# Altium project FusionVisionPCBScreen.PrjPcb
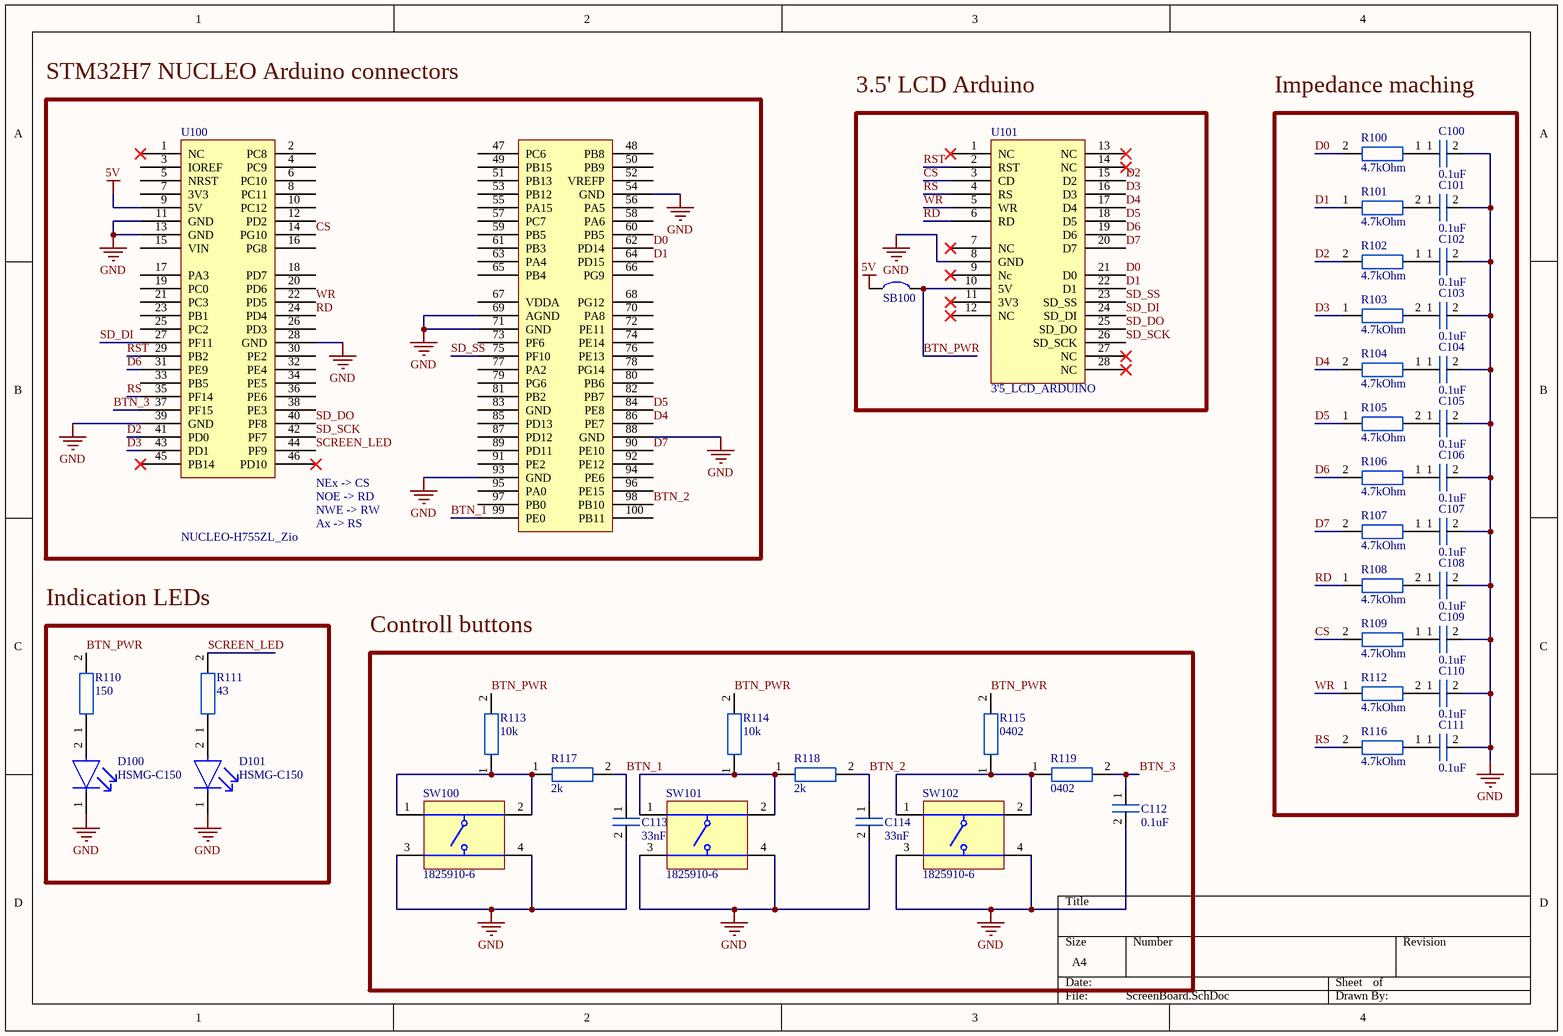
[diagram p0: ScreenBoard.SchDoc]
1 sheet, 43 parts. Net scope: global (net labels, ports and power ports of the same name join across sheets).
Board file: ScreenBoard.PcbDoc

## Sheet ScreenBoard.SchDoc
size A4; SheetNumber: 1; SheetTotal: 1

### Parts
C100  0.1uF  [0402_footprint]
C101  0.1uF  [0402_footprint]
C102  0.1uF  [0402_footprint]
C103  0.1uF  [0402_footprint]
C104  0.1uF  [0402_footprint]
C105  0.1uF  [0402_footprint]
C106  0.1uF  [0402_footprint]
C107  0.1uF  [0402_footprint]
C108  0.1uF  [0402_footprint]
C109  0.1uF  [0402_footprint]
C110  0.1uF  [0402_footprint]
C111  0.1uF  [0402_footprint]
C112  0.1uF  [0402_footprint]
C113  33nF  [0402_footprint]
C114  33nF  [0402_footprint]
D100  HSMG-C150  [FP-HSMG-C150-MFG]
D101  HSMG-C150  [FP-HSMG-C150-MFG]
R100  4.7kOhm  [0402_footprint]
R101  4.7kOhm  [0402_footprint]
R102  4.7kOhm  [0402_footprint]
R103  4.7kOhm  [0402_footprint]
R104  4.7kOhm  [0402_footprint]
R105  4.7kOhm  [0402_footprint]
R106  4.7kOhm  [0402_footprint]
R107  4.7kOhm  [0402_footprint]
R108  4.7kOhm  [0402_footprint]
R109  4.7kOhm  [0402_footprint]
R110  150  [0402_footprint]
R111  43  [0402_footprint]
R112  4.7kOhm  [0402_footprint]
R113  10k  [0402_footprint]
R114  10k  [0402_footprint]
R115  0402  [0402_footprint]
R116  4.7kOhm  [0402_footprint]
R117  2k  [0402_footprint]
R118  2k  [0402_footprint]
R119  0402  [0402_footprint]
SB100  Solder_bridge  [SOLDER_BRIDGE]  (value not drawn)
SW100  1825910-6  [TECO-1825910-6_V]
SW101  1825910-6  [TECO-1825910-6_V]
SW102  1825910-6  [TECO-1825910-6_V]
U100  NUCLEO-H755ZL_Zio  [H7/H5_NUCLEO_Zio]
U101  3'5_LCD_ARDUINO  [3'5_LCD_ARDUINO]

### Blocks framed on the sheet
STM32H7 NUCLEO Arduino connectors: U100
3.5' LCD Arduino: SB100 U101
Impedance maching: C100-C111 R100-R109 R112 R116
Indication LEDs: D100 D101 R110 R111
Controll buttons: C112-C114 R113-R115 R117-R119 SW100-SW102

### Nets
5V: SB100.1 U100.9(5V)
GND: C100.2 C101.2 C102.2 C103.2 C104.2 C105.2 C106.2 C107.2 C108.2 C109.2 C110.2 C111.2 C112.2 C113.2 C114.2 D100.1(C) D101.1(C) SW100.3 SW100.4 SW101.3 SW101.4 SW102.3 SW102.4 U100.11(GND) U100.13(GND) U100.28(GND) U100.39(GND) U100.54(GND) U100.69(AGND) U100.71(GND) U100.88(GND) U100.93(GND) U101.8(GND)
BTN_1: C113.1 R117.2 U100.99(PE0)
BTN_2: C114.1 R118.2 U100.98(PB10)
BTN_3: C112.1 R119.2 U100.37(PF15)
BTN_PWR: R110.2 R113.2 R114.2 R115.2 SB100.2 U101.10(5V)
CS: R109.2 U100.14(PG10) U101.3(CD)
D0: R100.2 U100.62(PD14) U101.21(D0)
D1: R101.1 U100.64(PD15) U101.22(D1)
D2: R102.2 U100.41(PD0) U101.15(D2)
D3: R103.1 U100.43(PD1) U101.16(D3)
D4: R104.2 U100.86(PE7) U101.17(D4)
D5: R105.1 U100.84(PE8) U101.18(D5)
D6: R106.2 U100.31(PE9) U101.19(D6)
D7: R107.2 U100.90(PE10) U101.20(D7)
RD: R108.1 U100.24(PD4) U101.6(RD)
RS: R116.2 U100.35(PF14) U101.4(RS)
RST: U100.29(PB2) U101.2(RST)
SCREEN_LED: R111.2 U100.44(PF9)
SD_DI: U100.27(PF11) U101.24(SD_DI)
SD_DO: U100.40(PF8) U101.25(SD_DO)
SD_SCK: U100.42(PF7) U101.26(SD_SCK)
SD_SS: U100.75(PF10) U101.23(SD_SS)
WR: R112.1 U100.22(PD5) U101.5(WR)
NetC100_1: C100.1 R100.1
NetC101_1: C101.1 R101.2
NetC102_1: C102.1 R102.1
NetC103_1: C103.1 R103.2
NetC104_1: C104.1 R104.1
NetC105_1: C105.1 R105.2
NetC106_1: C106.1 R106.1
NetC107_1: C107.1 R107.1
NetC108_1: C108.1 R108.2
NetC109_1: C109.1 R109.1
NetC110_1: C110.1 R112.2
NetC111_1: C111.1 R116.1
NetD100_2: D100.2(A) R110.1
NetD101_2: D101.2(A) R111.1
NetR113_1: R113.1 R117.1 SW100.1 SW100.2
NetR114_1: R114.1 R118.1 SW101.1 SW101.2
NetR115_1: R115.1 R119.1 SW102.1 SW102.2

Not connected (* = marked no-connect by the designer): U100 1(NC)* 2(PC8) 3(IOREF) 4(PC9) 5(NRST) 6(PC10) 7(3V3) 8(PC11) 10(PC12) 12(PD2) 15(VIN) 16(PG8) 17(PA3) 18(PD7) 19(PC0) 20(PD6) 21(PC3) 23(PB1) 25(PC2) 26(PD3) 30(PE2) 32(PE4) 33(PB5) 34(PE5) 36(PE6) 38(PE3) 45(PB14)* 46(PD10)* 47(PC6) 48(PB8) 49(PB15) 50(PB9) 51(PB13) 52(VREFP) 53(PB12) 55(PA15) 56(PA5) 57(PC7) 58(PA6) 59(PB5) 60(PB5) 61(PB3) 63(PA4) 65(PB4) 66(PG9) 67(VDDA) 68(PG12) 70(PA8) 72(PE11) 73(PF6) 74(PE14) 76(PE13) 77(PA2) 78(PG14) 79(PG6) 80(PB6) 81(PB2) 82(PB7) 83(GND) 85(PD13) 87(PD12) 89(PD11) 91(PE2) 92(PE12) 94(PE6) 95(PA0) 96(PE15) 97(PB0) 100(PB11); U101 1(NC)* 7(NC)* 9(Nc)* 11(3V3)* 12(NC)* 13(NC)* 14(NC)* 27(NC)* 28(NC)*

### Notes on the sheet
- (near U100) NEx -> CS
- (near U100) NOE -> RD
- (near U100) NWE -> RW
- (near U100) Ax -> RS

### Library data of the parts
C100-C114 = Capacitor_0402: 0402 capacitor
D100 D101 = CMP-2000-05061-2: LED GREEN DIFFUSED 1206 SMD; Manufacturer: Broadcom; Led Orientation: Top View; Max Junction Temp: +95°C; Peak Emmision Wavelength: 570nm; Viewing Angle: 170°; Wavelength: 572nm; Reverse Voltage: 5V; Luminous Intensity: 15mcd; Forward Voltage: 2.2V; Power Dissipation: 65mW; Forward Current: 20mA; ComponentLink2Description: Buy; Lead Free: Yes; Temperature Range Low: -40°C; Package: HSMG-C150; Digikey Description: LED GREEN DIFFUSED 1206 SMD; Mouser Description: LED Uni-Color Green 570nm 2-Pin Chip LED T/R; Manufacturer Part Number: HSMG-C150; Temperature Range High: +85°C; Device Class L1: Optoelectronics; Colour: Green; Category: Diode; Device Class L3: unset; RoHS: TRUE; Height: 1.2mm; ComponentLink2URL: https://www.mouser.lt/ProductDetail/Wurth-Elektronik/156120RS75000?qs=2kOmHSv6VfTlw4DhG%252BTIQw%3D%3D; Device Class L2: LEDs; Automotive: No; Ipc Land Pattern Name: DIOCP320160X55; Octopart: https://octopart.com/hsmg-c150-broadcom-71131304; Temperature: -40°C to +85°C
R100-R119 = Resistor_0402: 0402 resistor
SW100-SW102 = CMP-1684-00021-1: Tact Switch, SPST-NO, 0.05 A, -35 to 85 degC, 4-Pin THD, RoHS, Bulk; Manufacturer: TE Connectivity; Maximum Contact Resistance: 100mOhm; Mechanical Life: 100000Cycles; Bushing Type: Unthreaded; Switch Configuration: OFF(ON); Maximum DC Voltage Rating: 24V; Contact Rating @ Voltage: 0.05A@24VDC; Actuator Color: Black; Body Orientation: Straight; Function: MomentaryContact; Illumination: N/R; Actuator Style: RoundButton; Actuator Material: PolybutyleneTerephthalate; Dielectric Strength: 500VAC; Pole Throw Configuration: SPST; Actuator Length: 1.4mm; Product Weight: N/A; Contact Material: CopperAlloy; Housing Material: N/A; Terminal Type: PCPins; Minimum Insulation Resistance: 100MOhm; Package Description: 4-Pin Through Hole Device, Body 5.99 x 5.99 mm, Pitch 6.5 mm; Part No: 1825910-6; Package Reference: THD; Base Material: N/A; Manufacturer URL: http://www.te.com; Contact Plating: Silver; RoHS: Yes; Datasheet Version: Rev. C9; Electrical Life: 100000Cycles; Maximum AC Voltage Rating: N/A; Thread Size: N/R; Operating Temperature: -35to85C; Mounting: ThroughHole; Dimension: 5.99x5mm; Datasheet URL: http://www.te.com/commerce/DocumentDelivery/DDEController?Action=showdoc&DocId=Customer+Drawing%7F1825910%7FC9%7Fpdf%7FEnglish%7FENG_CD_1825910_C9.pdf%7F1825910-6; Family: 1825910; Seal Location: N/A; Seal Description: N/A; Packaging: N/A; ComponentLink1Description: Buy; ComponentLink1URL: https://www.mouser.lt/ProductDetail/CUI-Devices/TS02-66-55-BK-260-LCR-D?qs=A6eO%252BMLsxmT6x4NEvNu8bQ%3D%3D